# EAGLE schematic GameBoy_G12_v1 (EAGLE 9.7.0)
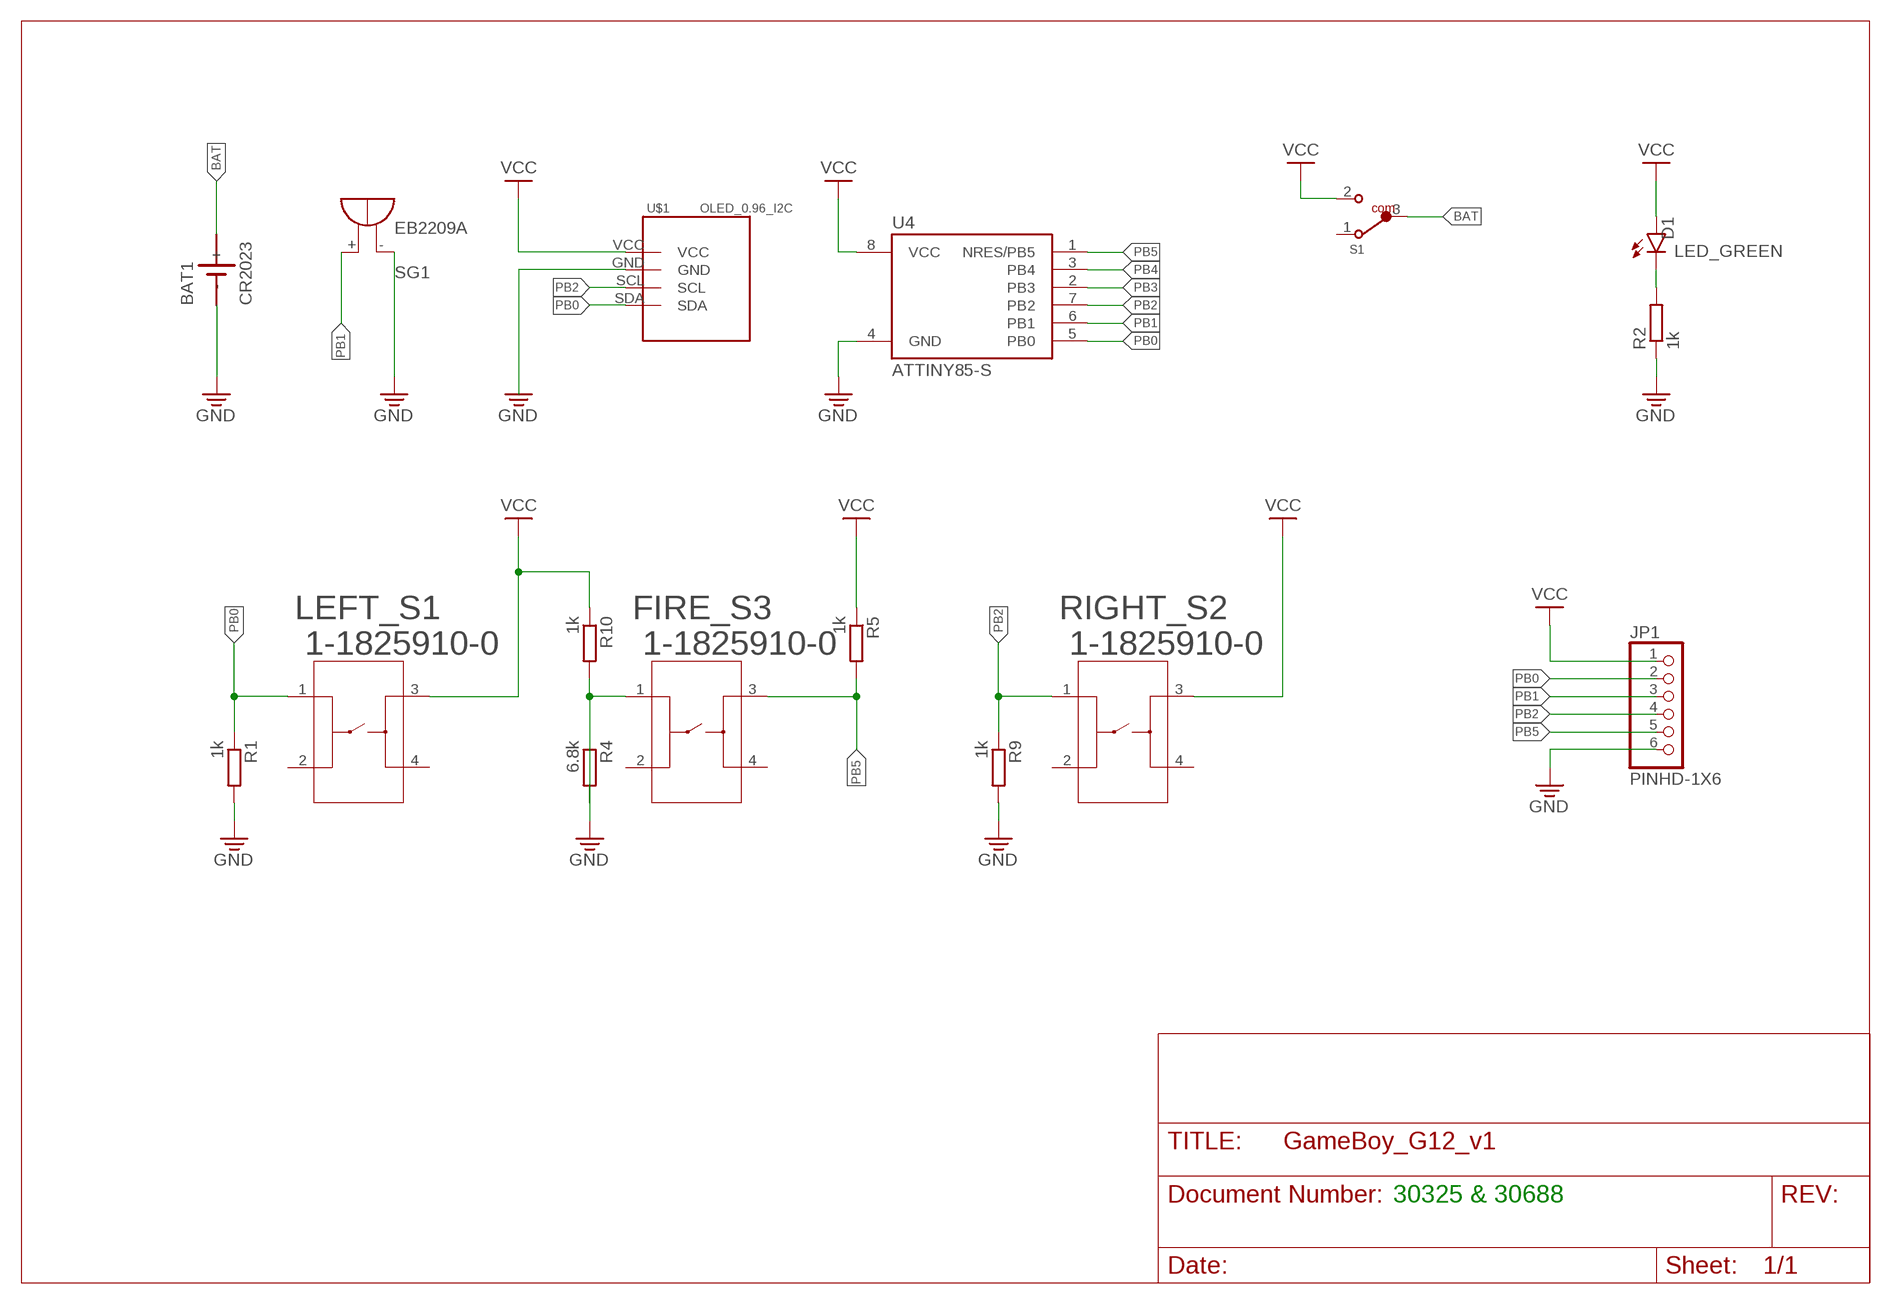
[diagram p0: schematic, sheet 1]

## Parts
BAT1  CR2023  SN2032  [SN2032]
D1  LED_GREEN  CHIP-FLAT-G_0402  [LEDC1005X25N_FLAT-G]
FIRE_S3  1-1825910-0  [SWITCH_1-1825910-0]
JP1  PINHD-1X6  [1X06]
LEFT_S1  1-1825910-0  [SWITCH_1-1825910-0]
R1  1k  R-EU_01005  [R01005]
R2  1k  R-EU_01005  [R01005]
R4  6.8k  R-EU_01005  [R01005]
R5  1k  R-EU_01005  [R01005]
R9  1k  R-EU_01005  [R01005]
R10  1k  R-EU_01005  [R01005]
RIGHT_S2  1-1825910-0  [SWITCH_1-1825910-0]
S1  450405020524  [450405020524]
SG1  EB2209A  [EB2209A]
U4  ATTINY85-S  [SOIC8_EIAJ_208MIL]
U$1  OLED_0.96_I2C  [OLED_0.96_I2C]

## Nets
BAT: BAT1.+ S1.3
GND: BAT1.- JP1.6 R1.2 R2.1 R4.1 R9.2 SG1.- U4.4(GND) U$1.GND
N$2: FIRE_S3.1 R4.2 R10.2
N$3: D1.C R2.2
PB0: JP1.2 LEFT_S1.1 R1.1 U4.5(PB0) U$1.SDA
PB1: JP1.3 SG1.+ U4.6(PB1)
PB2: JP1.4 R9.1 RIGHT_S2.1 U4.7(PB2) U$1.SCL
PB3: U4.2(PB3)
PB4: U4.3(PB4)
PB5: FIRE_S3.3 JP1.5 R5.2 U4.1(NRES/PB5)
VCC: D1.A JP1.1 LEFT_S1.3 R5.1 R10.1 RIGHT_S2.3 S1.2 U4.8(VCC) U$1.VCC
Unconnected: FIRE_S3.2 FIRE_S3.4 LEFT_S1.2 LEFT_S1.4 RIGHT_S2.2 RIGHT_S2.4 S1.1

## Notes on the sheet
- 30325 & 30688

## Library data of the parts
BAT1 = sn2032:SN2032: LI BATTERY
D1 = LED:CHIP-FLAT-G; CATEGORY: LED; COLOR: GREEN; DESCRIPTION: CHIP LED FLAT; SUB-CATEGORY: CHIP; TYPE: FLAT_TOP
FIRE_S3 LEFT_S1 RIGHT_S2 = Switches:1-1825910-0; BUILT_BY: EMA_UL_Team; CATEGORY: Tactile Switches; COPYRIGHT: Copyright (C) 2016 Accelerated Designs. All rights reserved; DESCRIPTION: FSM6JH=6MM TACT SWITCH, HIGH TEMP; MANUFACTURER_PART_NUMBER: 1-1825910-0; PART_STATUS: active; SERIES: Unknown; VENDOR: TE Connectivity
JP1 = Connector:PINHD-1X6: PIN HEADER; CATEGORY: Headers; DESCRIPTION: Header, Straight, 6 Position; MANUFACTURER: Generic; MPN: Generic; OPERATING_TEMPERATURE: Generic; PART_STATUS: Active; PITCH: 0.100" (2.54mm); ROHS_COMPLIANCE: Generic; SERIES: Generic; SUB-CATEGORY: Headers, Male Pins; TYPE: Board to Board or Cable, Unshrouded, Through Hole, Straight
R1 R2 R4 R5 R9 R10 = rcl:R-EU_: RESISTOR, European symbol; SPICEPREFIX: R
S1 = Wurth_Switch_WS-SLSU:450405020524: WS-SLSU SMT Mini Slide Switch Same Side Connection 8.7x3.0 mm PROPERTIES Actuator Material PA46 Actuator Flammability Rating UL94 HB Actuator Color Black Frame Material LCP Frame Flammability Rating UL94 V-0 Frame Color Black Contact Material Copper Alloy Contact Plating Silver Terminal Material Copper Alloy Terminal Plating Silver VR 5 V (DC) Contact Resistance Initial 70 mΩ Contact Resistance After Life Test 500 mΩ RISO 100 MΩ Withstanding Voltage 250 V (AC) ELECTRICAL PROPERTIES IR 300 mA MECHANICAL PROPERTIES Operation Force 225 g PACKAGING PROPERTIES Packaging Tape and Reel <https://katalog.we-online.com/media/images/v2/o158949v209%20WS-SLSU-450405020524.jpg> Details see: https://www.we-online.com/catalog/en/WS_SLSU_SMT_MINI_SLIDE_SWITCH_SAME_SIDE_8_7_x_3_0/ Updated by Ella Wu 2020-03-24 2020(C) Wurth Elektronik; DATASHEET-URL: https://www.we-online.com/catalog/datasheet/450405020524.pdf; IR: 300mA; PACKAGING: Tape and Reel; PART-NUMBER: 450405020524; VR: 5V(DC)
SG1 = buzzer:EB2209A: BUZZER Source: Buerklin; OC_FARNELL: unknown; OC_NEWARK: unknown
U4 = _hhn_attiny25_45_85:ATTINY85*: ATMEL ATtiny 85 Packages: P = PDIP 08 30mil S = SOIC 08 EIAJ 208mil Technologies Note: for complete ordering code (temp. range, finish, tape&reel etc.) see www.atmel.com • Supply Voltage: V = (1.8…5.5)V | [blank] = (2.7…5.5)V • Speed: 10 = 10 MHz | 20 = 20 MHz Author: Dipl.-Ing. FH Rainer Bayer HHN Hochschule Heilbronn (Heilbronn University), rainer.bayer@hs-heilbronn.de Ingenieurbüro ing-rb, mail@ing-rb.de
U$1 = tft_1_8_1_44_oled_0_96:OLED_0.96_I2C